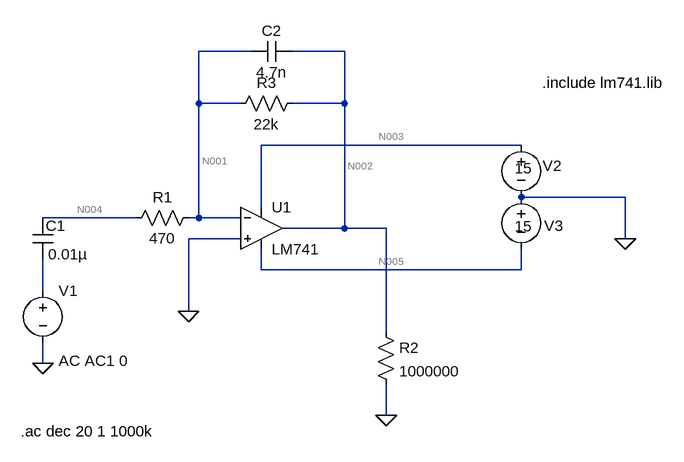
[diagram p0: schematic ActiveBandpassFilter.asc]
ActiveBandpassFilter.asc, the LTspice schematic file:
Version 4
SHEET 1 1088 680
WIRE 432 -144 352 -144
WIRE 576 -144 496 -144
WIRE 352 -64 352 -144
WIRE 416 -64 352 -64
WIRE 576 -64 576 -144
WIRE 576 -64 496 -64
WIRE 848 0 448 0
WIRE 1008 80 848 80
WIRE 448 96 448 0
WIRE 256 112 112 112
WIRE 352 112 352 -64
WIRE 352 112 336 112
WIRE 416 112 352 112
WIRE 576 128 576 -64
WIRE 576 128 480 128
WIRE 640 128 576 128
WIRE 416 144 336 144
WIRE 1008 144 1008 80
WIRE 448 192 448 160
WIRE 848 192 848 160
WIRE 848 192 448 192
WIRE 112 224 112 176
WIRE 336 256 336 144
WIRE 640 288 640 128
WIRE 112 336 112 304
WIRE 640 416 640 368
FLAG 112 336 0
FLAG 336 256 0
FLAG 1008 144 0
FLAG 640 416 0
SYMBOL voltage 112 208 R0
WINDOW 123 24 124 Left 2
WINDOW 39 0 0 Left 0
SYMATTR InstName V1
SYMATTR Value ""
SYMATTR Value2 AC AC1 0
SYMBOL cap 96 112 R0
WINDOW 0 20 12 Left 2
SYMATTR InstName C1
SYMATTR Value 0.01µ
SYMBOL res 352 96 R90
WINDOW 0 0 56 VBottom 2
WINDOW 3 32 56 VTop 2
SYMATTR InstName R1
SYMATTR Value 470
SYMBOL OpAmps\\opamp2 448 64 R0
SYMATTR InstName U1
SYMATTR Value LM741
SYMBOL voltage 848 -16 R0
WINDOW 0 33 48 Left 2
WINDOW 3 -10 52 Left 2
WINDOW 123 0 0 Left 0
WINDOW 39 0 0 Left 0
SYMATTR InstName V2
SYMATTR Value 15
SYMBOL voltage 848 64 R0
WINDOW 0 35 60 Left 2
WINDOW 3 -10 61 Left 2
WINDOW 123 0 0 Left 0
WINDOW 39 0 0 Left 0
SYMATTR InstName V3
SYMATTR Value 15
SYMBOL res 624 272 R0
SYMATTR InstName R2
SYMATTR Value 1000000
SYMBOL res 512 -80 R90
WINDOW 0 0 56 VBottom 2
WINDOW 3 32 56 VTop 2
SYMATTR InstName R3
SYMATTR Value 22k
SYMBOL cap 496 -160 R90
WINDOW 0 0 32 VBottom 2
WINDOW 3 32 32 VTop 2
SYMATTR InstName C2
SYMATTR Value 4.7n
TEXT 880 -96 Left 2 !.include lm741.lib
TEXT 78 440 Left 2 !.ac dec 20 1 1000k

The netlist it stands for:
* ActiveBandpassFilter.asc
V1 N006 0 AC AC1 0
C1 N004 N006 0.01µ
R1 N001 N004 470
XU1 0 N001 N003 N005 N002 LM741  ; pins In+ In- V+ V- OUT
V2 N003 0 15
V3 0 N005 15
R2 N002 0 1000000
R3 N002 N001 22k
C2 N002 N001 4.7n
.include lm741.lib
.ac dec 20 1 1000k
.backanno
.end

* Results of the author's LTspice run, read from the files saved beside the schematic
* Operating Point, zero values left out:
*   V(n004) = 1 mV
*   V(n001) = 1 mV
*   V(n005) = -15 V
*   V(n003) = 15 V
*   V(n002) = 3.241 mV
*   I(R2) = 3.241 nA
*   I(R3) = 101.9 nA
*   I(V2) = -1.701 mA
*   I(V3) = -1.701 mA
*   Ix(u1:1) = 57.86 nA
*   Ix(u1:2) = 101.9 nA
*   Ix(u1:99) = 1.701 mA
*   Ix(u1:50) = -1.701 mA
*   Ix(u1:28) = -105.1 nA
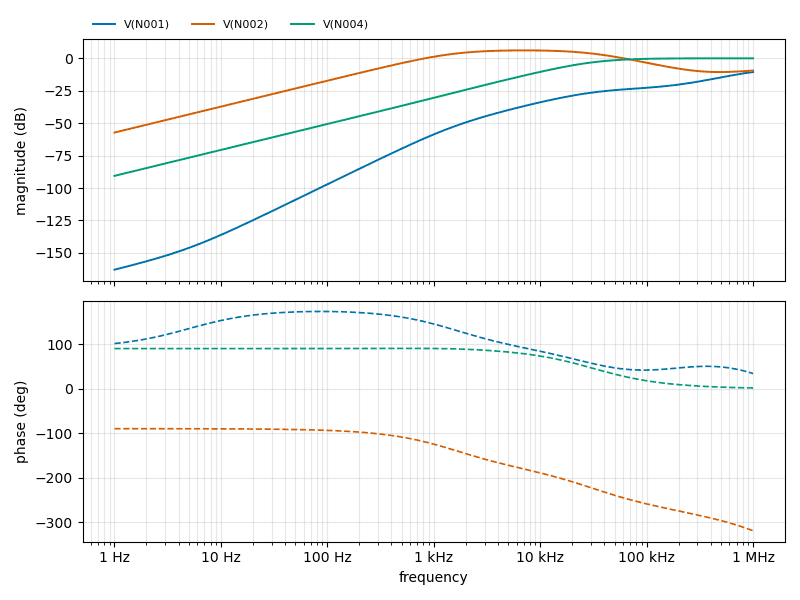
[diagram p1: AC Analysis of ActiveBandpassFilter.asc, plotted from the saved traces]
* AC Analysis, 1 run:
*   V(N001): -162.97 dB at 1 Hz, -10.53 dB at 1 MHz, peak -10.53 dB at 1 MHz, 3 dB below the peak at 591.6 kHz
*   V(N002): -57.19 dB at 1 Hz, -9.40 dB at 1 MHz, peak 6.18 dB at 7.079 kHz, 3 dB below the peak at 1.414 kHz and 35.14 kHz
*   V(N004): -90.59 dB at 1 Hz, 0.04 dB at 1 MHz, peak 0.06 dB at 562.3 kHz, 3 dB below the peak at 31.6 kHz